# Altium schematic sheet top.SchDoc
size A4
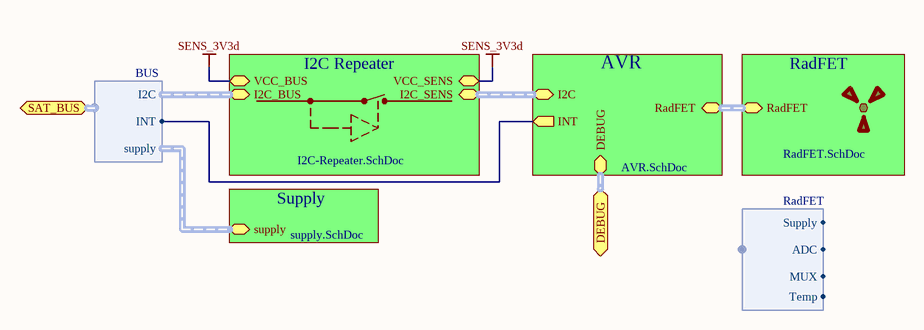
[diagram p0: top.SchDoc]

## Sub-sheets
AVR = AVR.SchDoc: I2C (harness I2C), RadFET (harness RadFET), DEBUG (harness DEBUG), INT (out)
I2C Repeater = I2C-Repeater.SchDoc: I2C_BUS (harness I2C), VCC_SENS, VCC_BUS, I2C_SENS (harness I2C)
RadFET = RadFET.SchDoc: RadFET (harness RadFET)
Supply = supply.SchDoc: supply (harness supply)

## Ports
DEBUG, SAT_BUS (harness BUS)

## Harnesses
BUS: I2C, supply, INT
RadFET: ADC, MUX, Supply, Temp

## Nets
SENS_3V3d: sheet I2C Repeater/VCC_SENS, sheet I2C Repeater/VCC_BUS
(unnamed): sheet AVR/INT, port SAT_BUS.INT

## Buses and harness runs
harness port DEBUG = sheet AVR/DEBUG
harness sheet AVR/I2C = sheet I2C Repeater/I2C_SENS
harness sheet AVR/RadFET = sheet RadFET/RadFET

## Notes on the sheet
- Title:
- Project:
- Author:
- Model:
- Document Number:
- Checked by:
- Rev:
- Date:
- Approved by:
- Sheet:
- of
- File name: